# EAGLE design sy88932l_sampler (EAGLE 9.2.2)
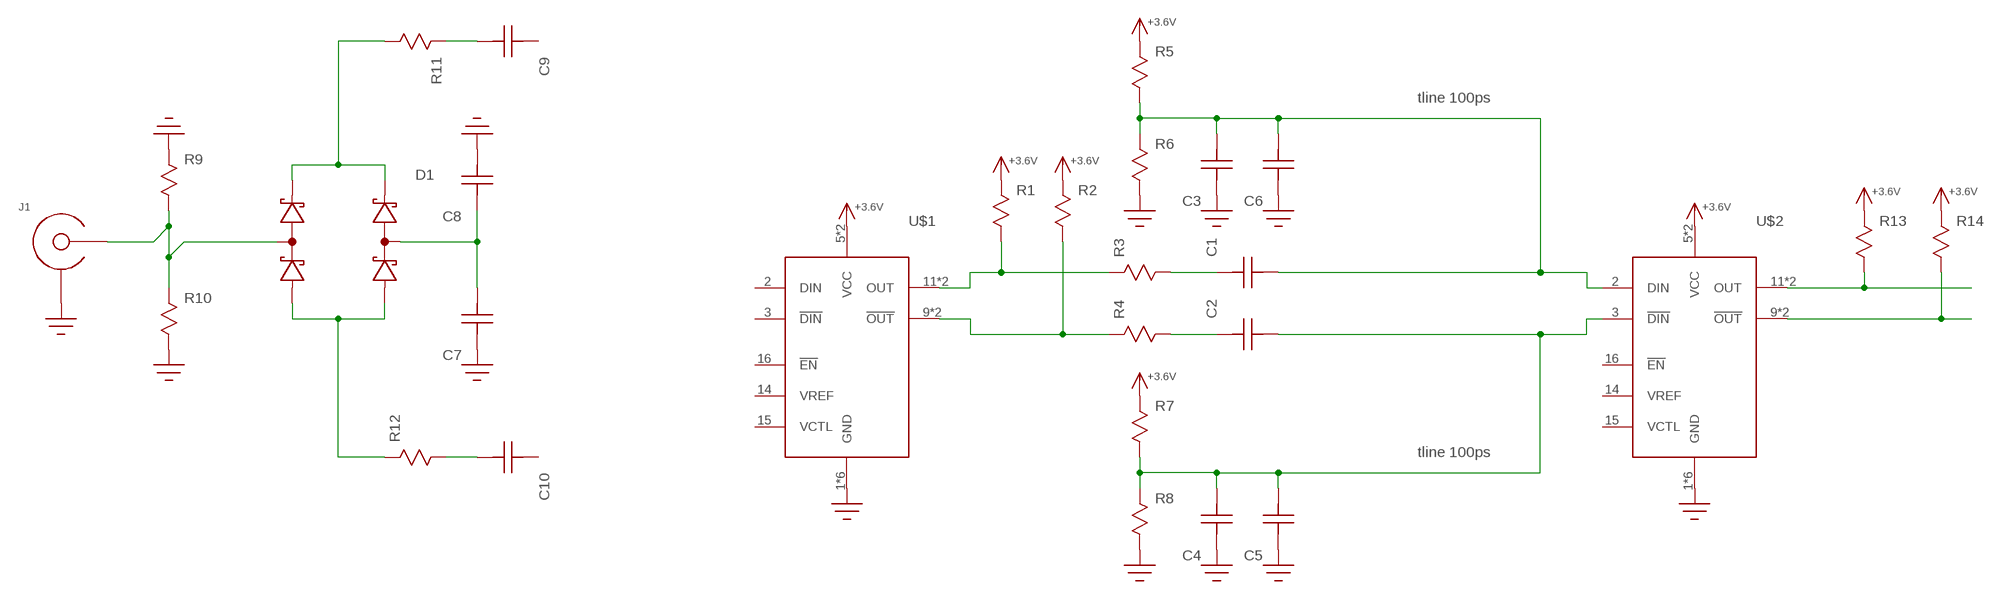
[diagram p0: schematic, sheet 1]

## Parts
C1  C0603  [C0603]
C2  C0603  [C0603]
C3  C0603  [C0603]
C4  C0603  [C0603]
C5  C  [C0402]
C6  C  [C0402]
C7  C  [C0402]
C8  C  [C0402]
C9  C  [C0402]
C10  C  [C0402]
D1  SMS3923-081  [SC-88]
J1  SMA_END_LAUNCH4L  [SMA_EDGE_LAUNCH]
R1  R0603  [R0603]
R2  R0603  [R0603]
R3  R0603  [R0603]
R4  R0603  [R0603]
R5  R0603  [R0603]
R6  R0603  [R0603]
R7  R0603  [R0603]
R8  R0603  [R0603]
R9  R0603  [R0603]
R10  R0603  [R0603]
R11  R0603  [R0603]
R12  R0603  [R0603]
R13  R0603  [R0603]
R14  R0603  [R0603]
U$1  SY88932L  [TQFN16]
U$2  SY88932L  [TQFN16]

## Nets
+3.6V: R1.P$1 R2.P$1 R5.P$1 R7.P$1 R13.P$1 R14.P$1 U$1.5(VCC) U$1.6(VCC) U$2.5(VCC) U$2.6(VCC)
GND: C3.P$2 C4.P$2 C5.2 C6.2 C7.2 C8.1 J1.BOTTOM_PAD(SHIELD) J1.GND@1(SHIELD) J1.GND@2(SHIELD) J1.GND@3(SHIELD) J1.GND@4(SHIELD) J1.GND@5(SHIELD) J1.GND@6(SHIELD) J1.GND@7(SHIELD) J1.GND@8(SHIELD) J1.GND@14(SHIELD) J1.GND@15(SHIELD) J1.GND@16(SHIELD) J1.GND@17(SHIELD) J1.GND_PAD1(SHIELD) J1.GND_PAD2(SHIELD) R6.P$2 R8.P$2 R9.P$1 R10.P$2 U$1.1(GND) U$1.4(GND) U$1.7(GND) U$1.8(GND) U$1.13(GND) U$1.EP(GND) U$2.1(GND) U$2.4(GND) U$2.7(GND) U$2.8(GND) U$2.13(GND) U$2.EP(GND)
N$1: R1.P$2 R3.P$1 U$1.11(OUT) U$1.12(OUT)
N$2: R2.P$2 R4.P$1 U$1.9(!OUT!) U$1.10(!OUT!)
N$3: C1.P$2 R3.P$2
N$4: C2.P$2 R4.P$2
N$5: C1.P$1 C3.P$1 C6.1 R5.P$2 R6.P$1 U$2.2(DIN)
N$6: D1.5(COMMON1) J1.CENTER@1(CENTER) J1.CENTER@2(CENTER) R9.P$2 R10.P$1
N$7: C2.P$1 C4.P$1 C5.1 R7.P$2 R8.P$1 U$2.3(!DIN!)
N$8: C7.1 C8.2 D1.2(COMMON0)
N$9: D1.1(ANODE0) D1.6(ANODE1) R12.P$1
N$10: D1.3(CATHODE0) D1.4(CATHODE1) R11.P$2
N$11: C9.1 R11.P$1
N$12: C10.1 R12.P$2
N$13: R13.P$2 U$2.11(OUT) U$2.12(OUT)
N$14: R14.P$2 U$2.9(!OUT!) U$2.10(!OUT!)
Unconnected: C9.2 C10.2 U$1.2(DIN) U$1.3(!DIN!) U$1.14(VREF) U$1.15(VCTL) U$1.16(!EN!) U$2.14(VREF) U$2.15(VCTL) U$2.16(!EN!)

## Notes on the sheet
- tline 100ps
- tline 100ps

## Library data of the parts
C1-C10 = yapo:C
D1 = yapo:SMS3923-081
J1 = yapo:SMA_END_LAUNCH
R1-R14 = yapo:R
U$1 U$2 = yapo:SY88932L

## Board
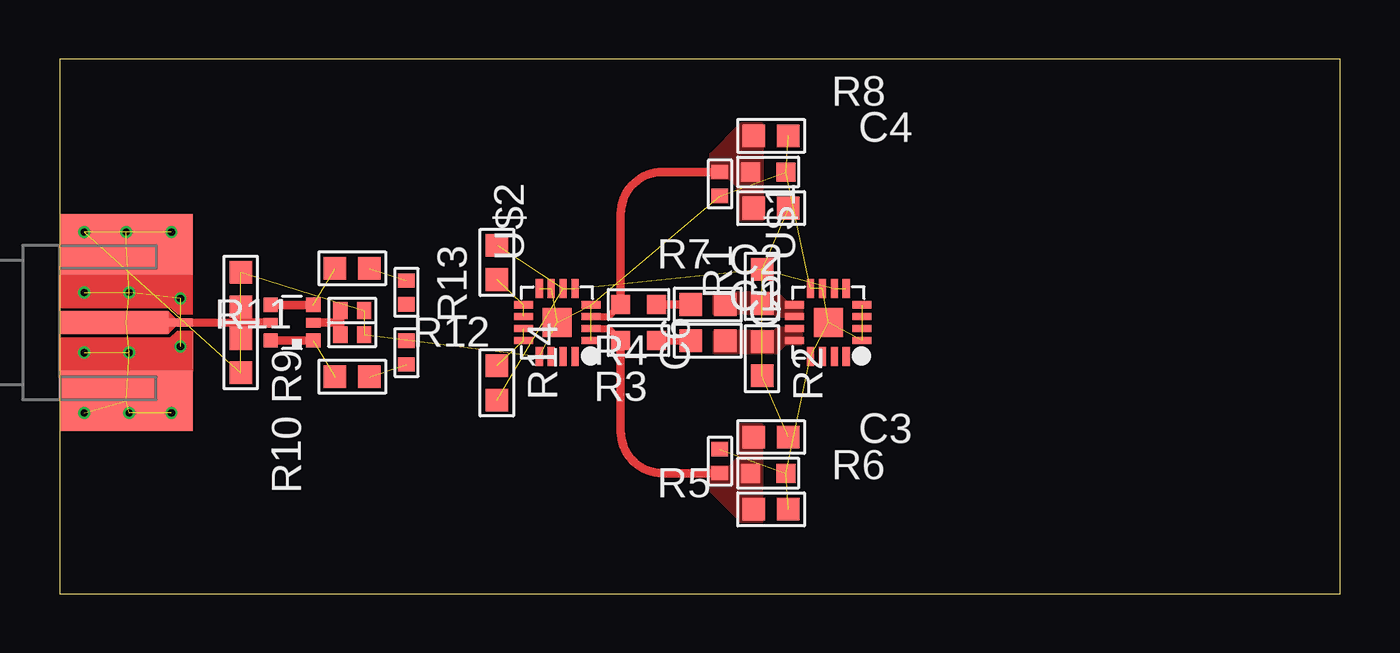
[diagram p1: board, top side]
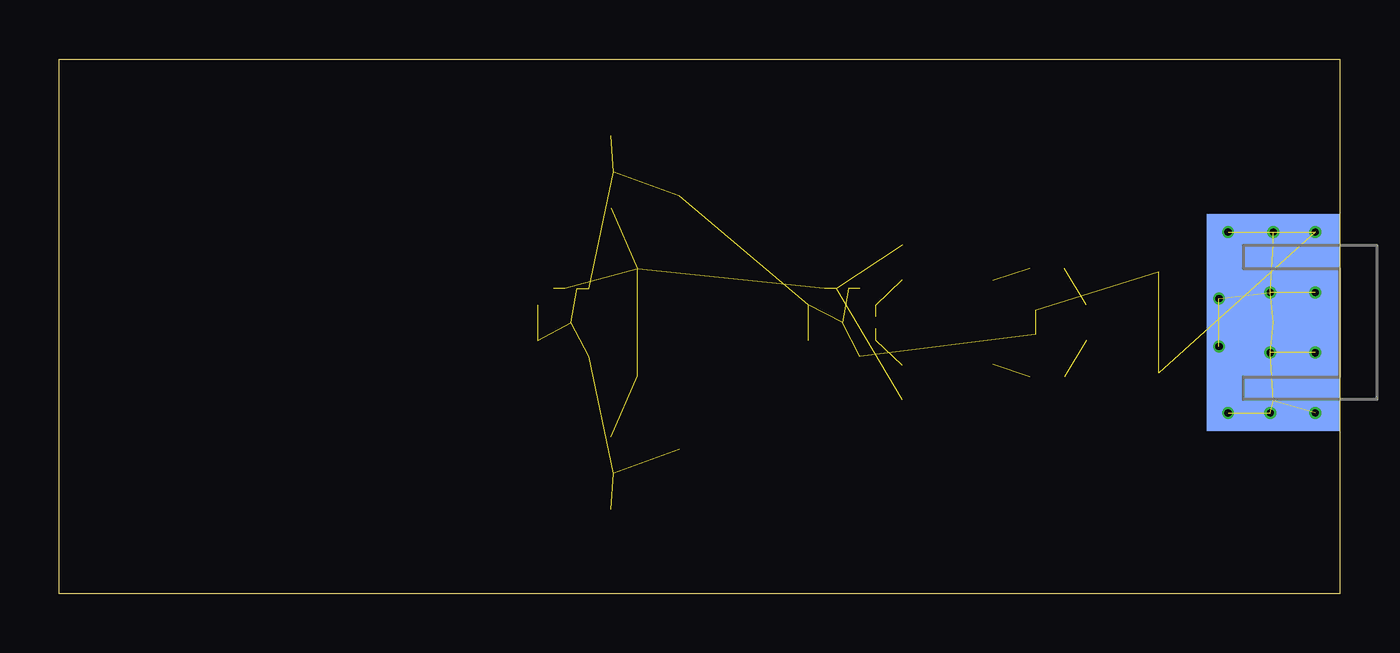
[diagram p2: board, bottom side, seen from below]

Size 53.95 x 22.53 mm. Coordinates in mm from the lower left corner, seen from the top.
Outline: 0,0 53.95,0 53.95,22.53 0,22.53 0,0
Copper layers (1*2*15*16): Top 0.035559375mm / dielectric 0.17018125mm / Route2 0.01778125mm / dielectric 47mil / Route15 0.01778125mm / dielectric 0.17018125mm / Bottom 0.035559375mm
Design rules "oshpark-4layer": minimum track width 5mil, minimum drill 10mil, track to track 5mil, track to pad 5mil, pad to pad 5mil, via to via 5mil, smd to smd 5mil, copper to edge 15mil, drill to drill 6mil, minimum pad ring 4mil, minimum via ring 4mil, stop-mask expansion 2.5mil, vias tented up to drill 0mil, thermal gap 10mil

### Footprints (pad centres in the part's own frame; a part is rotated, then mirrored left to right if it is on the bottom)
C0603 = smd 0.8 x 0.8: P$1 -0.75,0; P$2 0.75,0
C0402 = smd 0.6 x 0.7: 1 -0.5,0; 2 0.5,0
SC-88 = smd 0.6 x 0.6: 1 -0.9,0.75; 3 -0.9,-0.75; 4 0.9,-0.75; 6 0.9,0.75 | smd 0.6 x 0.4: 2 -0.9,0; 5 0.9,0
SMA_EDGE_LAUNCH = smd 5.588 x 9.144 bottom: BOTTOM_PAD 2.794,0 | smd 4.572 x 0.965: CENTER@1 2.286,0 | smd 1.016 x 0.33: CENTER@2 5.08,0 | drill 0.3: GND@1 1.016,3.81; GND@2 4.699,3.81; GND@3 1.016,1.27; GND@4 5.08,1.016; GND@5 1.016,-1.27; GND@6 5.08,-1.016; GND@7 1.016,-3.81; GND@8 4.699,-3.81; GND@14 2.794,3.81; GND@15 2.921,-3.81; GND@16 2.921,-1.27; GND@17 2.921,1.27 | smd 5.588 x 2.54: GND_PAD1 2.794,3.302; GND_PAD2 2.794,-3.302
R0603 = smd 0.95 x 0.95: P$1 -0.725,0; P$2 0.725,0
TQFN16 = smd 0.3 x 0.8: 1 -0.75,-1.425; 2 -0.25,-1.425; 3 0.25,-1.425; 4 0.75,-1.425; 9 0.75,1.425; 10 0.25,1.425; 11 -0.25,1.425; 12 -0.75,1.425 | smd 0.8 x 0.3: 5 1.425,-0.75; 6 1.425,-0.25; 7 1.425,0.25; 8 1.425,0.75; 13 -1.425,0.75; 14 -1.425,0.25; 15 -1.425,-0.25; 16 -1.425,-0.75 | smd 1.23 x 1.23: EP 0,0

### Placement (x,y rotation side)
C1  24.38,10.67 0 top
C2  24.38,12.19 0 top
C3  29.84,5.08 0 top
C4  29.84,17.78 0 top
C5  27.81,17.27 270 top
C6  27.81,5.59 90 top
C7  12.32,11.94 0 top
C8  12.32,10.92 180 top
C9  14.61,12.7 270 top
C10  14.61,10.16 90 top
D1  9.78,11.43 180 top
J1  0,11.43 0 top
R1  29.59,9.91 90 top
R2  29.59,12.95 270 top
R3  27.3,10.67 180 top
R4  27.3,12.19 180 top
R5  29.97,6.6 180 top
R6  29.97,3.56 0 top
R7  29.97,16.26 180 top
R8  29.97,19.3 0 top
R9  7.62,12.83 270 top
R10  7.62,10.03 270 top
R11  12.32,13.72 180 top
R12  12.32,9.14 0 top
R13  18.41,8.89 90 top
R14  18.41,13.97 270 top
U$1  32.38,11.43 90 top
U$2  20.95,11.43 90 top

### Tracks (layer width: path | path; a pad name or v marks a point on that pad's centre or on a via)
+3.6V  (9 unrouted)
GND  (36 unrouted)
N$1
  pour Top (no thermals): 31.24,11.18 30.23,11.18 30.1,11.05 27.56,11.05 27.56,10.16 30.23,10.16 30.61,10.54 31.24,10.54
N$2
  pour Top (no thermals): 27.56,12.7 30.23,12.7 30.61,12.32 31.24,12.32 31.24,11.68 30.23,11.68 30.1,11.81 27.56,11.81
N$3
  Top 0.356: R3.P$2 C1.P$2
N$4
  Top 0.356: R4.P$2 C2.P$2
N$5
  Top 0.305: U$2.2 23.12,11.18 C1.P$1 | C6.1 arc90 C6.1 | C6.1 arc90 C6.1 | C6.1 arc90 C6.1 | C3.P$1 arc-90 C3.P$1 | 29.12,5.12 arc-90 C3.P$1 | 29.12,5.05 arc90 C3.P$1
  Top 0.356: C1.P$1 23.63,6.85 arc90 25.4,5.08 C6.1
  pour Top (no thermals): 27.43,4.32 28.7,3.05 29.59,3.05 29.59,7.11 28.57,7.11 28.57,5.71 28.19,5.33 27.43,5.33
N$6
  Top 0.33: J1.CENTER@1 J1.CENTER@2 7.62,11.43
  Top 0.356: 7.62,11.43 D1.5 | R9.P$2 7.62,11.43 | R10.P$1 7.62,11.43
N$7
  Top 0.305: U$2.3 23.12,11.68 C2.P$1 | 27.68,17.78 arc-90 27.69,17.77 | C4.P$1 arc90 C4.P$1 | 29.12,17.8 arc-90 C4.P$1 | 29.12,17.74 arc90 C4.P$1
  Top 0.356: C2.P$1 23.63,16.01 arc-90 25.4,17.78 C5.1 arc-90 C5.1
  pour Top (no thermals): 29.59,19.81 29.59,15.75 28.57,15.75 28.57,17.14 28.19,17.53 27.43,17.53 27.43,18.54 28.7,19.81
N$8
  Top 0.356: C7.1 11.82,11.43 | 11.82,11.43 C8.2 | D1.2 11.82,11.43
N$9  (1 unrouted)
  Top 0.356: D1.6 D1.1
N$10  (1 unrouted)
  Top 0.356: D1.4 D1.3
N$11  (1 unrouted)
N$12  (1 unrouted)
N$13  (2 unrouted)
N$14  (2 unrouted)